# EasyEDA schematic cockpitV3- XPDNR- support mega 2560_2021-01-12_14-07-31.json
TITLE: Sheet_2; REV: 1.0; Date: 2021-01-02; Sheet: 1/1; Drawn By: krok; Company: Your Company
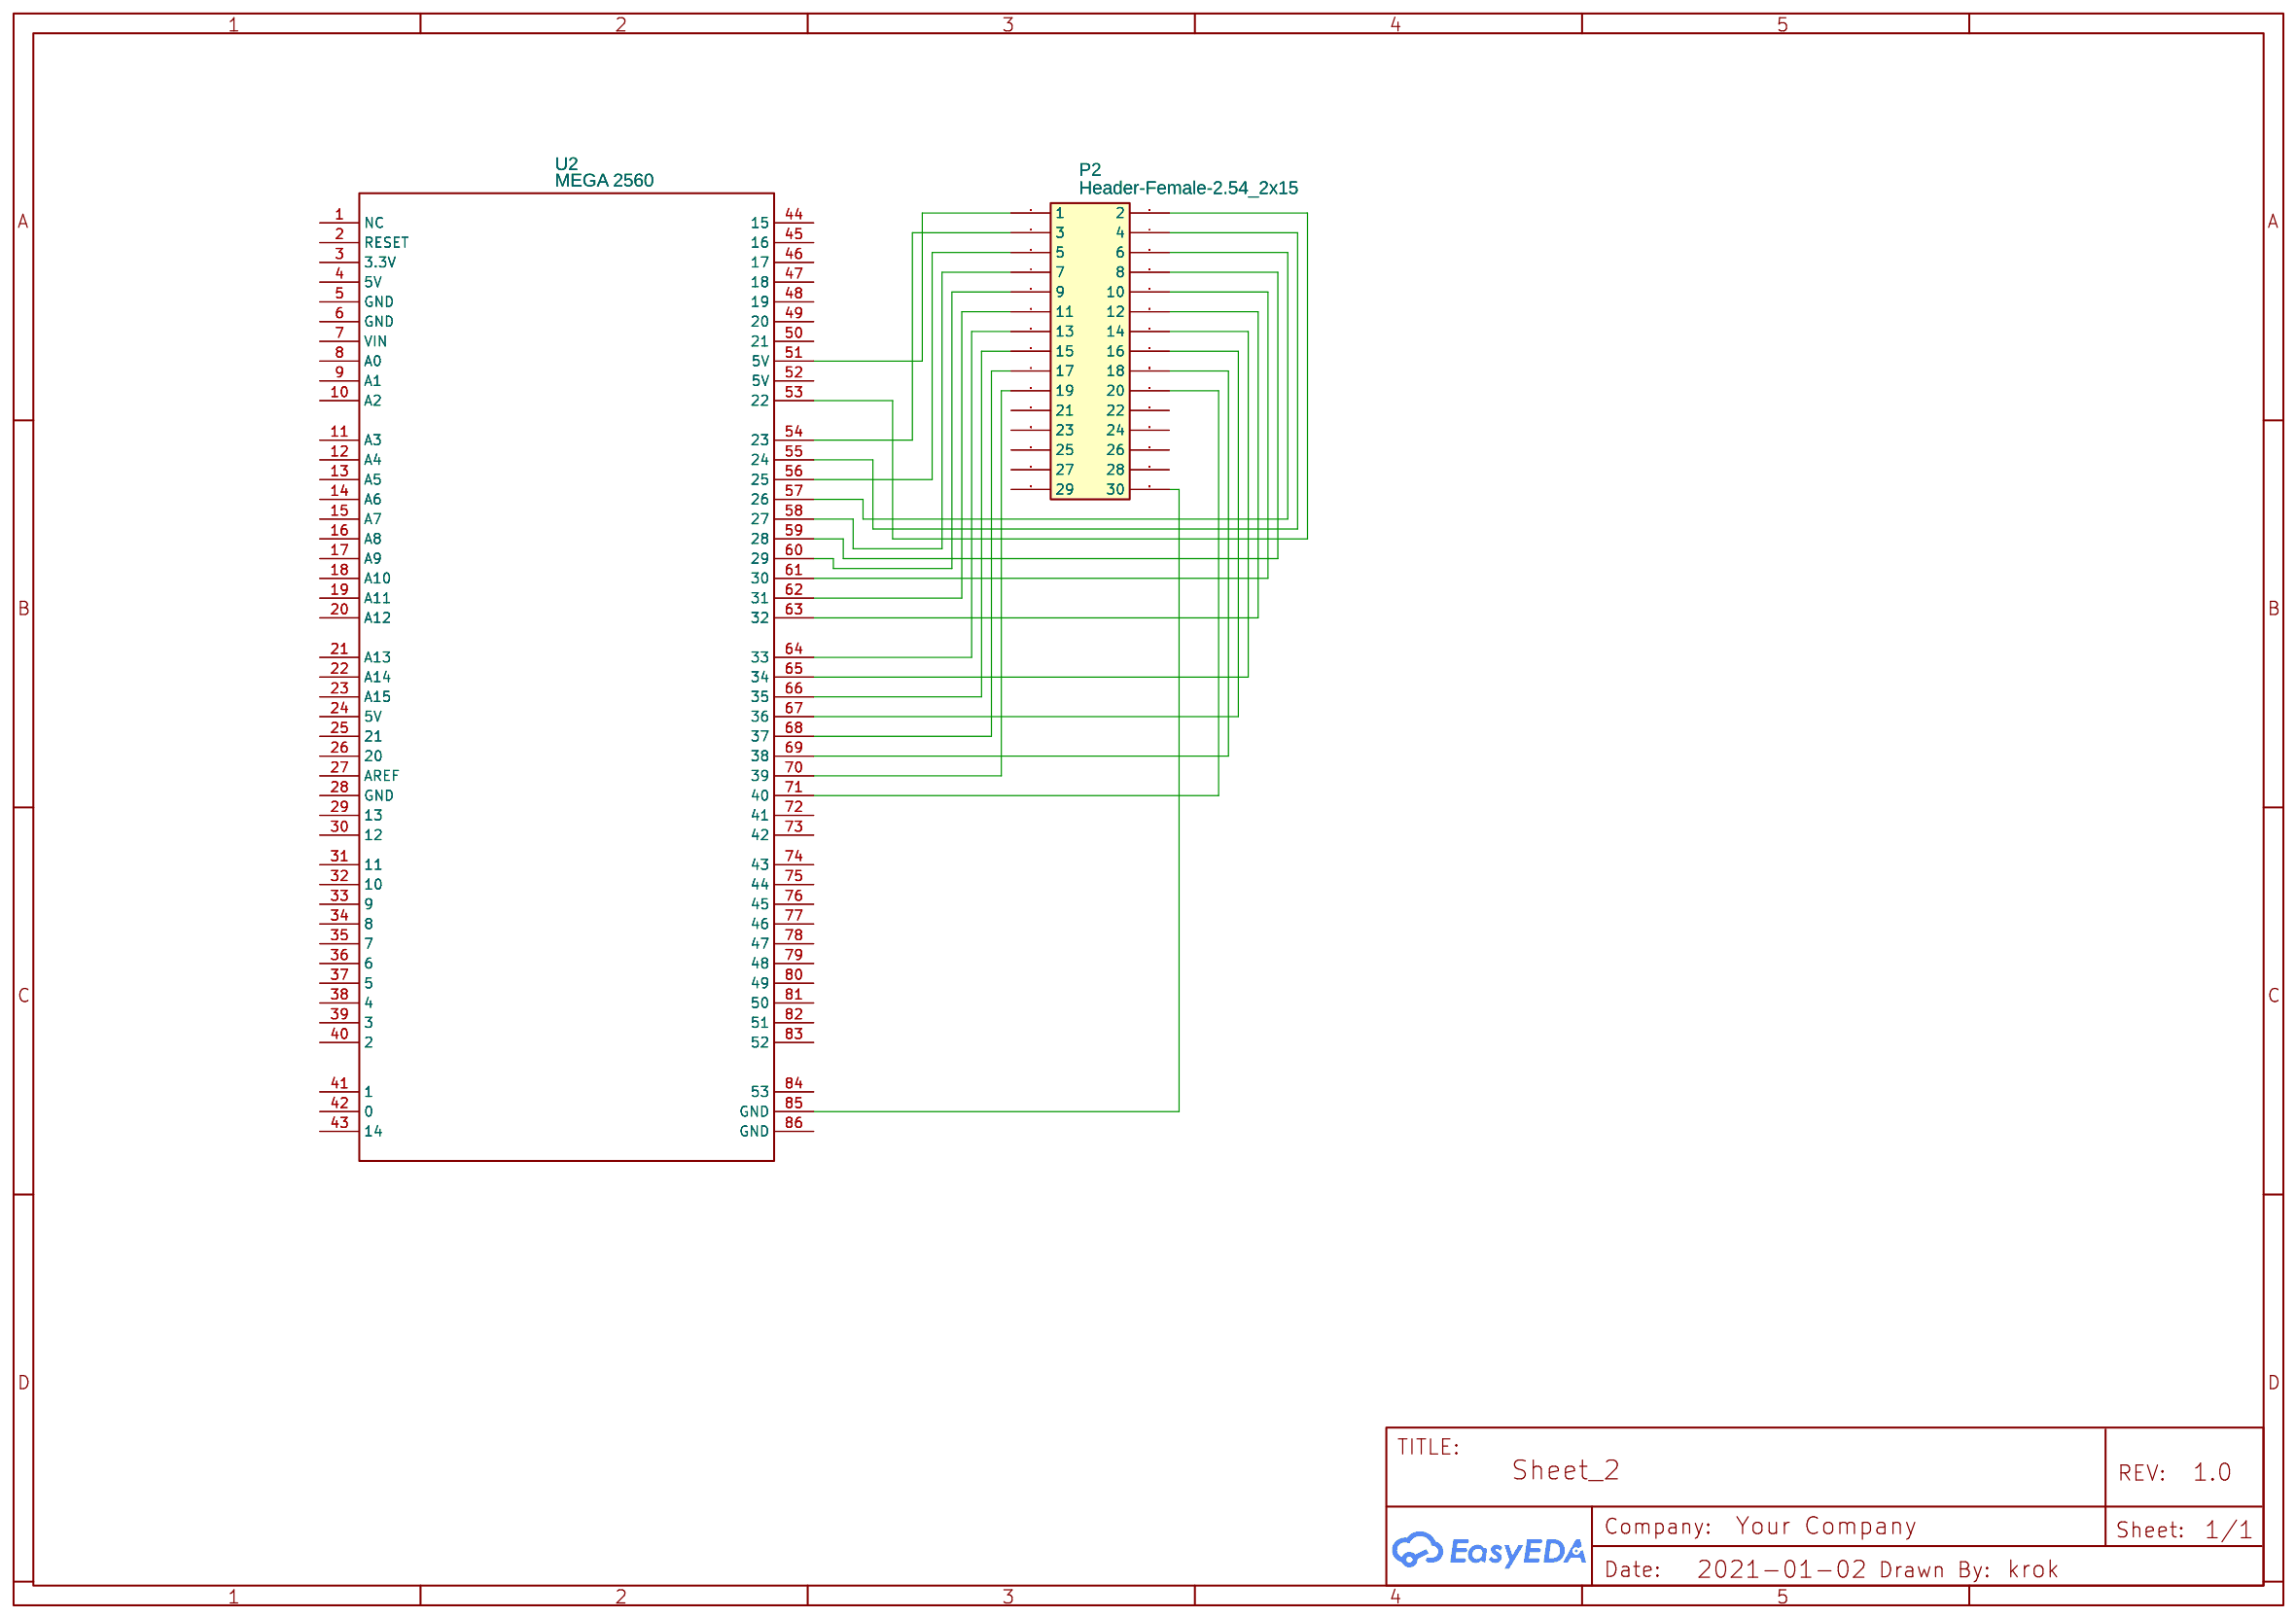
[diagram p0: schematic sheet]

## Parts
P2  Header-Female-2.54_2x15  [HDR-15X2/2.54]
U2  MEGA 2560  [MEGA 2560]

## Library data of the parts
P2 = Header-Female-2.54_2x15: Supplier Part: E58377; Package Display: No
U2 = MEGA 2560: subpart_no: 1; Contributor: ALIRIO “DASTRAS” SOLANO

## Nets
Net-(P2-1): P2.1 U2.51(5V)
Net-(P2-2): P2.2 U2.53(22)
Net-(P2-3): P2.3 U2.54(23)
Net-(P2-4): P2.4 U2.55(24)
Net-(P2-5): P2.5 U2.56(25)
Net-(P2-6): P2.6 U2.57(26)
Net-(P2-7): P2.7 U2.58(27)
Net-(P2-8): P2.8 U2.59(28)
Net-(P2-9): P2.9 U2.60(29)
Net-(P2-10): P2.10 U2.61(30)
Net-(P2-11): P2.11 U2.62(31)
Net-(P2-12): P2.12 U2.63(32)
Net-(P2-13): P2.13 U2.64(33)
Net-(P2-14): P2.14 U2.65(34)
Net-(P2-15): P2.15 U2.66(35)
Net-(P2-16): P2.16 U2.67(36)
Net-(P2-17): P2.17 U2.68(37)
Net-(P2-18): P2.18 U2.69(38)
Net-(P2-19): P2.19 U2.70(39)
Net-(P2-20): P2.20 U2.71(40)
Net-(P2-30): P2.30 U2.85(GND)

Not connected (* = marked no-connect by the designer): P2 21 22 23 24 25 26 27 28 29; U2 1(NC) 2(RESET) 3(3.3V) 4(5V) 5(GND) 6(GND) 7(VIN) 8(A0) 9(A1) 10(A2) 11(A3) 12(A4) 13(A5) 14(A6) 15(A7) 16(A8) 17(A9) 18(A10) 19(A11) 20(A12) 21(A13) 22(A14) 23(A15) 24(5V) 25(21) 26(20) 27(AREF) 28(GND) 29(13) 30(12) 31(11) 32(10) 33(9) 34(8) 35(7) 36(6) 37(5) 38(4) 39(3) 40(2) 41(1) 42(0) 43(14) 44(15) 45(16) 46(17) 47(18) 48(19) 49(20) 50(21) 52(5V) 72(41) 73(42) 74(43) 75(44) 76(45) 77(46) 78(47) 79(48) 80(49) 81(50) 82(51) 83(52) 84(53) 86(GND)
